# Altium schematic sheet Communication_Part2.SchDoc
size A4
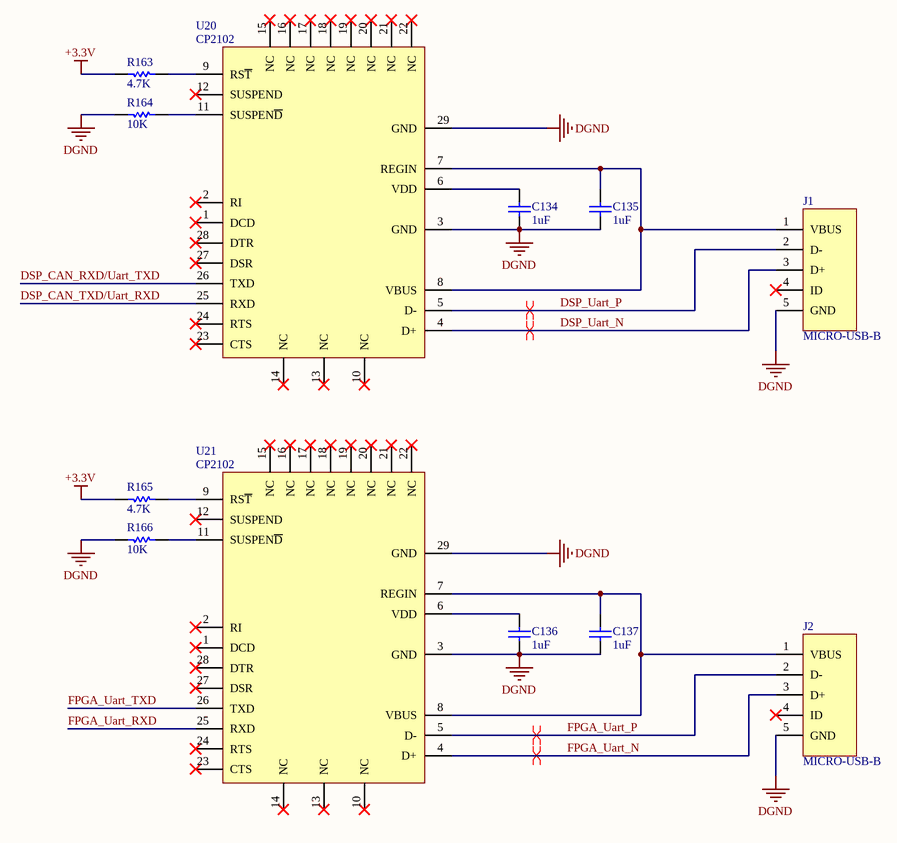
[diagram p0: Communication_Part2.SchDoc]

## Parts
C134  value 1uF  [1608[0603]]  (hidden comment: Cap)
C135  value 1uF  [1608[0603]]  (hidden comment: Cap)
C136  value 1uF  [1608[0603]]  (hidden comment: Cap)
C137  value 1uF  [1608[0603]]  (hidden comment: Cap)
J1  MICRO-USB-B  [MICRO-USB-B]
J2  MICRO-USB-B  [MICRO-USB-B]
R163  value 4.7K  [1608[0603]]  (hidden comment: Res1)
R164  value 10K  [1608[0603]]  (hidden comment: Res1)
R165  value 4.7K  [1608[0603]]  (hidden comment: Res1)
R166  value 10K  [1608[0603]]  (hidden comment: Res1)
U20  CP2102  [CP2102_QFN28]
U21  CP2102  [CP2102_QFN28]

## Nets
+3.3V: R163.1 R165.1
DGND: C134.2 C135.2 C136.2 C137.2 J1.5(GND) J2.5(GND) R164.1 R166.1 U20.3(GND) U20.29(GND) U21.3(GND) U21.29(GND)
DSP_CAN_RXD/Uart_TXD: U20.26(TXD)
DSP_CAN_TXD/Uart_RXD: U20.25(RXD)
DSP_Uart_N: J1.3(D+) U20.4(D+)
DSP_Uart_P: J1.2(D-) U20.5(D-)
FPGA_Uart_N: J2.3(D+) U21.4(D+)
FPGA_Uart_P: J2.2(D-) U21.5(D-)
FPGA_Uart_RXD: U21.25(RXD)
FPGA_Uart_TXD: U21.26(TXD)
NetC134_1: C134.1 U20.6(VDD)
NetC135_1: C135.1 J1.1(VBUS) U20.7(REGIN) U20.8(VBUS)
NetC136_1: C136.1 U21.6(VDD)
NetC137_1: C137.1 J2.1(VBUS) U21.7(REGIN) U21.8(VBUS)
NetR163_2: R163.2 U20.9(RS~{T})
NetR164_2: R164.2 U20.11(SUSPEN~{D})
NetR165_2: R165.2 U21.9(RS~{T})
NetR166_2: R166.2 U21.11(SUSPEN~{D})

Not connected (* = marked no-connect by the designer): J1 4(ID)*; J2 4(ID)*; U20 1(DCD)* 2(RI)* 10(NC)* 12(SUSPEND)* 13(NC)* 14(NC)* 15(NC)* 16(NC)* 17(NC)* 18(NC)* 19(NC)* 20(NC)* 21(NC)* 22(NC)* 23(CTS)* 24(RTS)* 27(DSR)* 28(DTR)*; U21 1(DCD)* 2(RI)* 10(NC)* 12(SUSPEND)* 13(NC)* 14(NC)* 15(NC)* 16(NC)* 17(NC)* 18(NC)* 19(NC)* 20(NC)* 21(NC)* 22(NC)* 23(CTS)* 24(RTS)* 27(DSR)* 28(DTR)*

## Layout directives
differential pair: DSP_Uart_N, DSP_Uart_P, FPGA_Uart_N, FPGA_Uart_P

## Library data of the parts
C134-C137 = Cap: Capacitor; Published: 8-Jun-2000; LatestRevisionDate: 17-Jul-2002; LatestRevisionNote: Re-released for DXP Platform.; PackageReference: RAD-0.3; Publisher: Altium Limited; PackageDescription: Radial Cap, Thru-Hole; 2 Leads; 0.3 in Pin Spacing
R163-R166 = Res1: Resistor; Published: 8-Jun-2000; LatestRevisionDate: 17-Jul-2002; LatestRevisionNote: Re-released for DXP Platform.; PackageReference: AXIAL-0.3; Publisher: Altium Limited; PackageDescription: Axial Device, Thru-Hole; 2 Leads; 0.3 in Pin Spacing
U20 U21 = CP2102: PART_DESC: SINGLE-CHIP USB TO UART BRIDGE, QFN28, RoHS.; MFG_#1: SILICON LABS; PART_NUMBER: CP2102; VALUE: CP2102; Type: Type; RefDes: RefDes